# EAGLE design actik-retrofit-r1 (EAGLE 9.6.2)
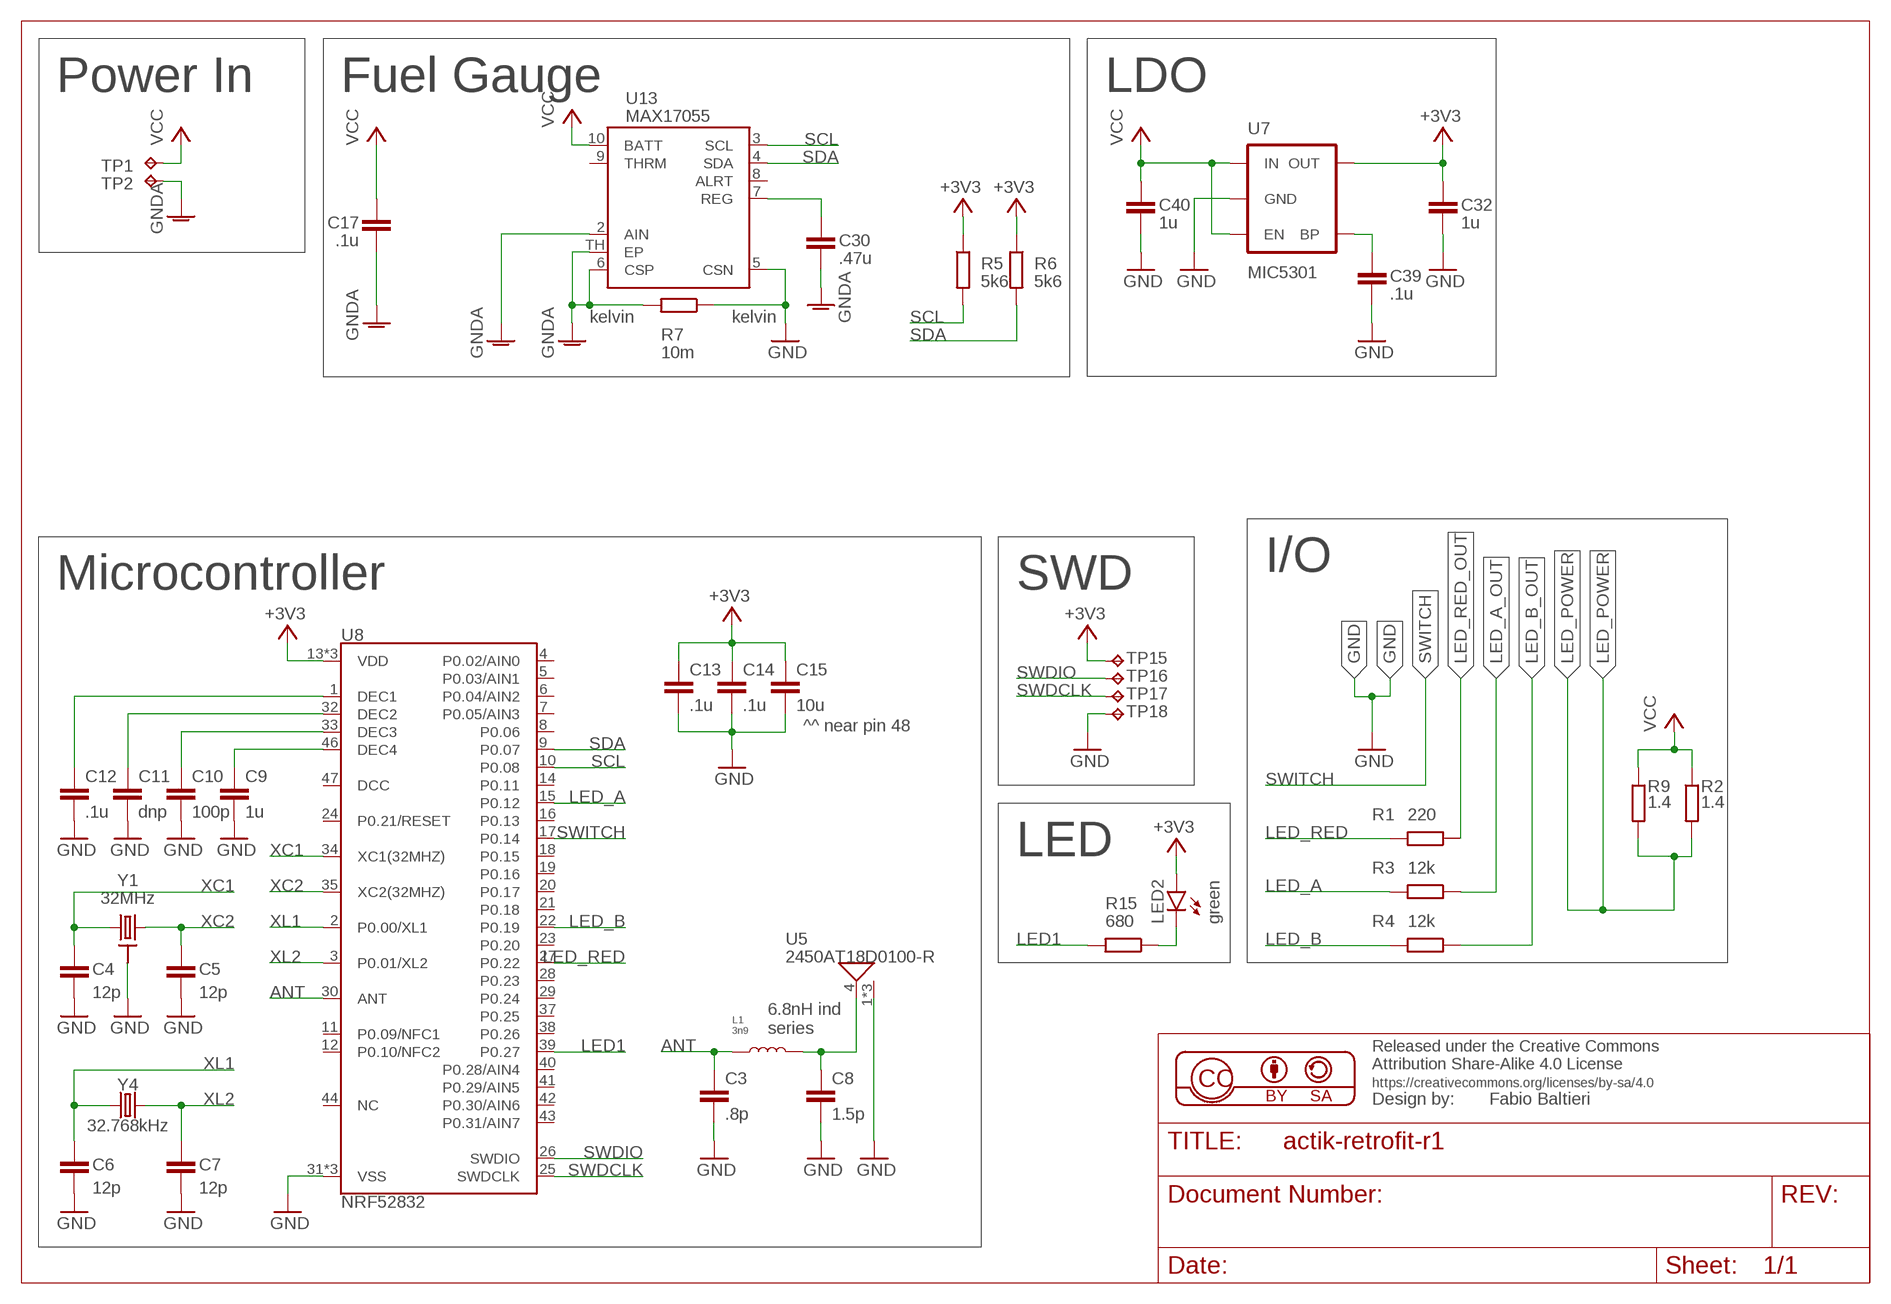
[diagram p0: schematic, sheet 1]

## Parts
C3  .8p  C0603  [0603]
C4  12p  C0603  [0603]
C5  12p  C0603  [0603]
C6  12p  C0603  [0603]
C7  12p  C0603  [0603]
C8  1.5p  C0603  [0603]
C9  1u  C0603  [0603]
C10  100p  C0603  [0603]
C11  dnp  C0603  [0603]
C12  .1u  C0603  [0603]
C13  .1u  C0603  [0603]
C14  .1u  C0603  [0603]
C15  10u  C0603  [0603]
C17  .1u  C0603  [0603]
C30  .47u  C0603  [0603]
C32  1u  C0603  [0603]
C39  .1u  C0603  [0603]
C40  1u  C0603  [0603]
L1  3n9  INDUCTOR_0603  [L0603]
LED2  green  LEDSML0805  [SML0805]
R1  220  R0603  [0603]
R2  1.4  R-EU_R3225  [R3225]
R3  12k  R0603  [0603]
R4  12k  R0603  [0603]
R5  5k6  R0603  [0603]
R6  5k6  R0603  [0603]
R7  10m  R0603  [0603]
R9  1.4  R-EU_R3225  [R3225]
R15  680  R0603  [0603]
TP1  TPPAD1-13  [P1-13]
TP2  TPPAD1-13  [P1-13]
TP15  TPTP10R  [TP10R]
TP16  TPTP10R  [TP10R]
TP17  TPTP10R  [TP10R]
TP18  TPTP10R  [TP10R]
U5  2450AT18D0100-R  [2450AT18D0100-R]
U7  MIC5301  V_REG_LDOSMD  [SOT23-5]
U8  NRF52832  [QFN48-6X6MM]
U13  MAX17055  [TDFN10-2X2.5]
Y1  32MHz  XTAL-GND-2X1.6  [XTAL-2X1.6]
Y4  32.768kHz  CRYSTAL-32.768KHZSMD-3.2X1.5  [CRYSTAL-SMD-3.2X1.5MM]

## Nets
+3V3: C13.1 C14.1 C15.1 C32.1 LED2.A R5.1 R6.1 TP15.TP U7.5(OUT) U8.13(VDD) U8.36(VDD) U8.48(VDD)
ANT: C3.1 L1.P$1 U8.30(ANT)
GND: C3.2 C4.2 C5.2 C6.2 C7.2 C8.2 C9.2 C10.2 C11.2 C12.2 C13.2 C14.2 C15.2 C32.2 C39.2 C40.2 R7.1 TP18.TP U5.1(GND) U5.2(GND) U5.3(GND) U7.2(GND) U8.31(VSS) U8.45(VSS) U8.EP(VSS) U13.5(CSN) Y1.2(GND) Y1.4(GND)
GNDA: C17.2 C30.2 R7.2 TP2.TP U13.2(AIN) U13.6(CSP) U13.TH(EP)
LED1: R15.2 U8.39(P0.27)
LED_A: R3.2 U8.15(P0.12)
LED_A_OUT: R3.1
LED_B: R4.2 U8.22(P0.19)
LED_B_OUT: R4.1
LED_POWER: R2.2 R9.2
LED_RED: R1.2 U8.27(P0.22)
LED_RED_OUT: R1.1
N$1: C8.1 L1.P$2 U5.4(FEED)
N$2: C9.1 U8.46(DEC4)
N$3: C10.1 U8.33(DEC3)
N$4: C11.1 U8.32(DEC2)
N$5: C12.1 U8.1(DEC1)
N$23: LED2.C R15.1
N$30: C39.1 U7.4(BP)
N$47: C30.1 U13.7(REG)
SCL: R5.2 U8.10(P0.08) U13.3(SCL)
SDA: R6.2 U8.9(P0.07) U13.4(SDA)
SWDCLK: TP17.TP U8.25(SWDCLK)
SWDIO: TP16.TP U8.26(SWDIO)
SWITCH: U8.17(P0.14)
VCC: C17.1 C40.1 R2.1 R9.1 TP1.TP U7.1(IN) U7.3(EN) U13.10(BATT)
XC1: C4.1 U8.34(XC1(32MHZ)) Y1.1
XC2: C5.1 U8.35(XC2(32MHZ)) Y1.3
XL1: C6.1 U8.2(P0.00/XL1) Y4.P$1
XL2: C7.1 U8.3(P0.01/XL2) Y4.P$2
Unconnected: U8.4(P0.02/AIN0) U8.5(P0.03/AIN1) U8.6(P0.04/AIN2) U8.7(P0.05/AIN3) U8.8(P0.06) U8.11(P0.09/NFC1) U8.12(P0.10/NFC2) U8.14(P0.11) U8.16(P0.13) U8.18(P0.15) U8.19(P0.16) U8.20(P0.17) U8.21(P0.18) U8.23(P0.20) U8.24(P0.21/RESET) U8.28(P0.23) U8.29(P0.24) U8.37(P0.25) U8.38(P0.26) U8.40(P0.28/AIN4) U8.41(P0.29/AIN5) U8.42(P0.30/AIN6) U8.43(P0.31/AIN7) U8.44(NC) U8.47(DCC) U13.8(ALRT) U13.9(THRM)

## Notes on the sheet
- Power In | Fuel Gauge | LDO
- kelvin | kelvin
- I/O
- Microcontroller | SWD
- ^^ near pin 48
- LED
- 6.8nH ind
  series

## Library data of the parts
C3-C15 C17 C30 C32 C39 C40 = balto:C: Capacitor
L1 = MF_Passives:INDUCTOR: Library: MF_Passives Description: Device for Inductors. Manufacture part number (MPN) can be added via Attributes. Check https://factory.macrofab.com/parts for the house parts list.; POPULATE: 1
LED2 = led:LED: LED OSRAM: - CHIPLED LG R971, LG N971, LY N971, LG Q971, LY Q971, LO R971, LY R971 LH N974, LH R974 LS Q976, LO Q976, LY Q976 LO Q996 - Hyper CHIPLED LW Q18S LB Q993, LB Q99A, LB R99A - SideLED LS A670, LO A670, LY A670, LG A670, LP A670 LB A673, LV A673, LT A673, LW A673 LH A674 LY A675 LS A676, LA A676, LO A676, LY A676, LW A676 LS A679, LY A679, LG A679 - Hyper Micro SIDELED® LS Y876, LA Y876, LO Y876, LY Y876 LT Y87S - SmartLED LW L88C, LW L88S LB L89C, LB L89S, LG L890 LS L89K, LO L89K, LY L89K LS L896, LA L896, LO L896, LY L896 - TOPLED LS T670, LO T670, LY T670, LG T670, LP T670 LSG T670, LSP T670, LSY T670, LOP T670, LYG T670 LG T671, LOG T671, LSG T671 LB T673, LV T673, LT T673, LW T673 LH T674 LS T676, LA T676, LO T676, LY T676, LB T676, LH T676, LSB T676, LW T676 LB T67C, LV T67C, LT T67C, LS T67K, LO T67K, LY T67K, LW E67C LS E67B, LA E67B, LO E67B, LY E67B, LB E67C, LV E67C, LT E67C LW T67C LS T679, LY T679, LG T679 LS T770, LO T770, LY T770, LG T770, LP T770 LB T773, LV T773, LT T773, LW T773 LH T774 LS E675, LA E675, LY E675, LS T675 LS T776, LA T776, LO T776, LY T776, LB T776 LHGB T686 LT T68C, LB T68C - Hyper Mini TOPLED® LB M676 - Mini TOPLED Santana® LG M470 LS M47K, LO M47K, LY M47K Source: http://www.osram.convergy.de LUXEON: - LUMILED® LXK2-PW12-R00, LXK2-PW12-S00, LXK2-PW14-U00, LXK2-PW14-V00 LXK2-PM12-R00, LXK2-PM12-S00, LXK2-PM14-U00 LXK2-PE12-Q00, LXK2-PE12-R00, LXK2-PE12-S00, LXK2-PE14-T00, LXK2-PE14-U00 LXK2-PB12-K00, LXK2-PB12-L00, LXK2-PB12-M00, LXK2-PB14-N00, LXK2-PB14-P00, LXK2-PB14-Q00 LXK2-PR12-L00, LXK2-PR12-M00, LXK2-PR14-Q00, LXK2-PR14-R00 LXK2-PD12-Q00, LXK2-PD12-R00, LXK2-PD12-S00 LXK2-PH12-R00, LXK2-PH12-S00 LXK2-PL12-P00, LXK2-PL12-Q00, LXK2-PL12-R00 Source: www.luxeon.com KINGBRIGHT: KA-3528ASYC Source: www.kingbright.com
R1 R3-R7 R15 = balto:R: Resistor
R2 R9 = rcl:R-EU_: RESISTOR, European symbol; SPICEPREFIX: R
TP1 TP2 TP15-TP18 = testpad:TP: Test pad
U5 = balto:2450AT18D0100: 2.45 GHz SMD Antenna, EIA 1210, Detuning resilient, Edge Mount Design
U7 = SparkFun-PowerIC:V_REG_LDO: Voltage Regulator LDO Standard 150mA LDO voltage regulator in SOT-23 layout. Micrel part MIC5205. BP (by-pass) pin is used to lower output noise with 470pF cap.
U8 = SparkFun-RF:NRF52832: Nordic nRF52832 Bluetooth Smart/ANT/2.4GHz RF SoC The nRF52832 SoC is a powerful, highly flexible ultra-low power multiprotocol SoC ideally suited for Bluetooth® Smart ANT and 2.4GHz ultra low-power wireless applications. The nRF52832 SoC is built around a 32-bit ARM® Cortex™-M4F CPU with 512kB + 64kB RAM. The embedded 2.4GHz transceiver supports Bluetooth Smart, ANT and proprietary 2.4 GHz protocol stack. It is on air compatible with the nRF51 Series, nRF24L and nRF24AP Series products from Nordic Semiconductor. Datasheet <https://cdn.sparkfun.com/datasheets/Wireless/Bluetooth/nRF52832_PS_v1.0.pdf> SparkFun Products: SparkFun nRF52832 Breakout <https://www.sparkfun.com/products/13990>; PROD_ID: IC-13460
U13 = balto:MAX17055: 7μA 1-Cell Fuel Gauge with ModelGauge m5 EZ
Y1 = balto:XTAL-GND: Crystal Oscillator with GND
Y4 = SparkFun-Clocks:CRYSTAL-32.768KHZ: 32.768kHz Crystal Frequency: 32.768kHz Frequency Stability: ±20ppm Load Capacitance: 12.5pF (PTH-2X6 & SMD-3.2X1.5), 6pF (SMD-2X6) SparkFun Products: SparkFun BigTime Watch Kit <https://www.sparkfun.com/products/11734> SparkFun nRF52832 Breakout <https://www.sparkfun.com/products/13990> SparkFun Real Time Clock Module <https://www.sparkfun.com/products/12708>; PROD_ID: XTAL-13062

## Net classes
0 default: width 0.2 mm

## Board
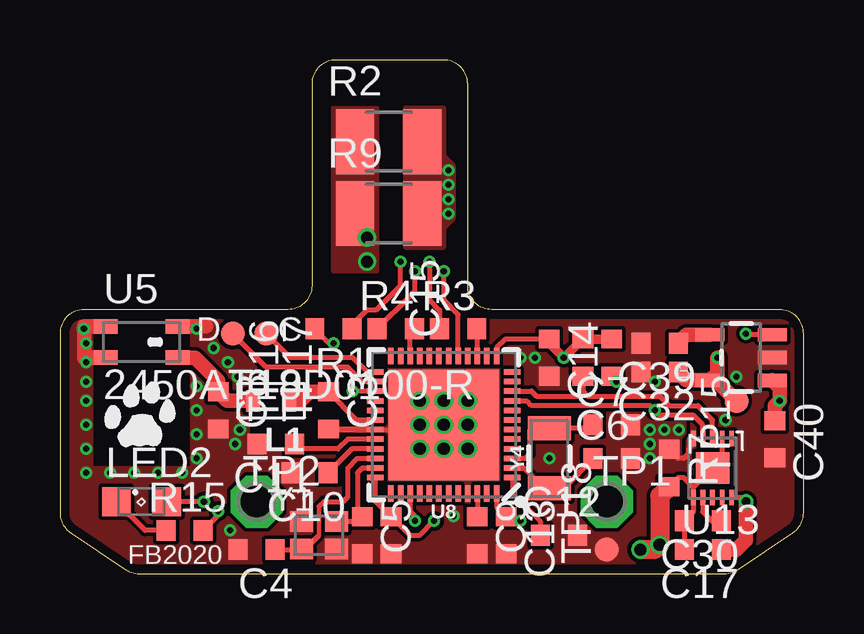
[diagram p1: board, top side]
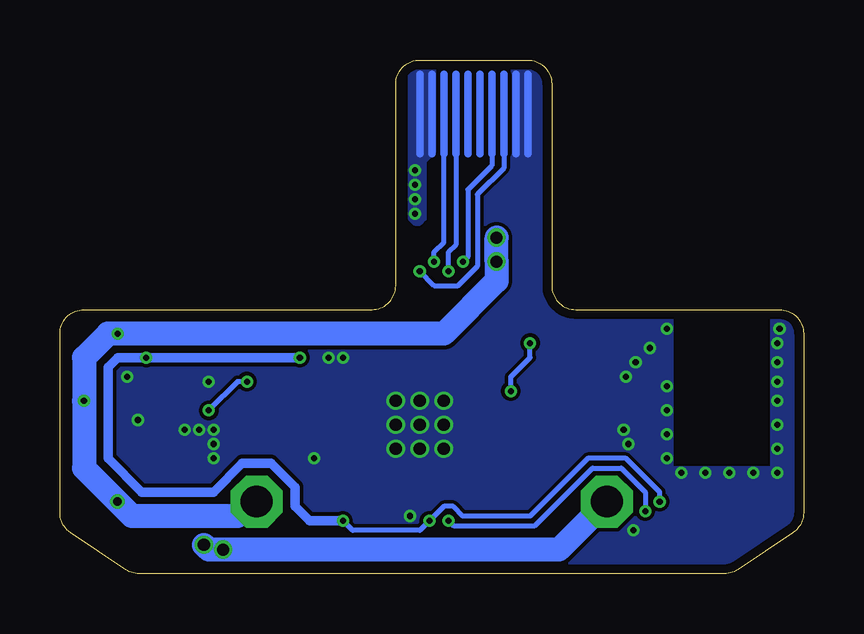
[diagram p2: board, bottom side, seen from below]

Size 31 x 21.4 mm. Coordinates in mm from the lower left corner, seen from the top.
Outline: 17,12 17,20.4 arc90 16,21.4 11.5,21.4 arc90 10.5,20.4 10.5,12 arc-90 9.5,11 1,11 arc90 0,10 0,2.54 arc56 0.45,1.7 2.75,0.17 arc34 3.3,0 27.7,0 arc34 28.25,0.17 30.55,1.7 arc56 31,2.54 31,10 arc90 30,11 18,11 arc-90 17,12
Copper layers (1*16): Top 0.035mm / dielectric 1.5mm / Bottom 0.035mm
Design rules "balto *": minimum track width 6mil, minimum drill 10mil, track to track 6mil, track to pad 6mil, pad to pad 6mil, via to via 6mil, smd to smd 6mil, copper to edge 15mil, drill to drill 5mil, minimum pad ring 5mil, minimum via ring 5mil, stop-mask expansion 2mil, vias tented up to drill 20mil, thermal gap 8mil
tRestrict: 3 lines

### Footprints (pad centres in the part's own frame; a part is rotated, then mirrored left to right if it is on the bottom)
0603 = smd 0.787 x 0.864: 1 -0.774,0; 2 0.774,0
L0603 = smd 0.6 x 0.9: P$1 -0.75,0; P$2 0.75,0
SML0805 = smd 1.2 x 1.2: A 1.05,0; C -1.05,0
R3225 = smd 1.6 x 2.7: 1 -1.4,0; 2 1.4,0
P1-13 = drill 1.321 pad 2.159 octagon: TP 0,0
TP10R = smd 1 x 1: TP 0,0
2450AT18D0100-R = smd 1 x 0.6: 1 1.5,0.65; 2 -1.5,0.65; 3 -1.5,-0.65; 4 1.5,-0.65
SOT23-5 = smd 0.55 x 1.2: 1 -0.95,-1.3; 2 0,-1.3; 3 0.95,-1.3; 4 0.95,1.3; 5 -0.95,1.3
QFN48-6X6MM = smd 0.68 x 0.23: 1 -2.86,2.2; 2 -2.86,1.8; 3 -2.86,1.4; 4 -2.86,1; 5 -2.86,0.6; 6 -2.86,0.2; 7 -2.86,-0.2; 8 -2.86,-0.6; 9 -2.86,-1; 10 -2.86,-1.4; 11 -2.86,-1.8; 12 -2.86,-2.2; 25 2.86,-2.2; 26 2.86,-1.8; 27 2.86,-1.4; 28 2.86,-1; 29 2.86,-0.6; 30 2.86,-0.2; 31 2.86,0.2; 32 2.86,0.6; 33 2.86,1; 34 2.86,1.4; 35 2.86,1.8; 36 2.86,2.2 | smd 0.23 x 0.68: 13 -2.2,-2.86; 14 -1.8,-2.86; 15 -1.4,-2.86; 16 -1,-2.86; 17 -0.6,-2.86; 18 -0.2,-2.86; 19 0.2,-2.86; 20 0.6,-2.86; 21 1,-2.86; 22 1.4,-2.86; 23 1.8,-2.86; 24 2.2,-2.86; 37 2.2,2.86; 38 1.8,2.86; 39 1.4,2.86; 40 1,2.86; 41 0.6,2.86; 42 0.2,2.86; 43 -0.2,2.86; 44 -0.6,2.86; 45 -1,2.86; 46 -1.4,2.86; 47 -1.8,2.86; 48 -2.2,2.86 | smd 4.6 x 4.6: EP 0,0
TDFN10-2X2.5 = smd 0.2 x 0.65: 1 -0.8,-1.225; 2 -0.4,-1.225; 3 0,-1.225; 4 0.4,-1.225; 5 0.8,-1.225; 6 0.8,1.225; 7 0.4,1.225; 8 0,1.225; 9 -0.4,1.225; 10 -0.8,1.225 | smd 1.4 x 1.3: TH 0,0
XTAL-2X1.6 = smd 0.95 x 0.85: 1 -0.725,-0.575; 2 0.725,-0.575; 3 0.725,0.575; 4 -0.725,0.575
CRYSTAL-SMD-3.2X1.5MM = smd 1 x 1.8: P$1 -1.25,0; P$2 1.25,0

### Placement (x,y rotation side)
C3  11.2,6.8 270 top
C4  8.2,1 180 top
C5  12.6,1.6 270 top
C6  23,4.8 0 top
C7  23,6.2 0 top
C8  6.6,6.8 270 top
C9  17.4,1.6 270 top
C10  10.4,4.2 180 top
C11  9,5.4 180 top
C12  20.8,1.6 0 top
C13  18.6,1.6 270 top
C14  20.4,9 270 top
C15  13.8,1.6 270 top
C17  26.8,1 180 top
C30  26.8,2.2 180 top
C32  25,8.4 180 top
C39  25,9.6 180 top
C40  29.8,5.6 270 top
L1  8.8,7.2 180 top
LED2  3.4,3 0 top
R1  11.4,10.2 180 top
R2  13.7,18 0 top
R3  16.6,10.2 0 top
R4  14,10.2 0 top
R5  21.8,9 270 top
R6  23,9 270 top
R7  25.4,4.4 270 top
R9  13.7,15 0 top
R15  5.2,1.8 0 top
TP1  22.8,3 0 top
TP2  8.2,3 0 top
TP15  28.2,7.2 90 top
TP16  7.2,10 270 top
TP17  8.6,10 270 top
TP18  22.8,1 90 top
U5  3.4,9.65 0 top
U7  28.4,9 90 top
U8  16,6.2 180 top
U13  27.2,4.4 180 top
U$1  [CAT-L]  3.4,6.2 0 top
Y1  10.8,1.6 0 top
Y4  20.4,4.8 90 top

### Tracks (layer width: path | path; a pad name or v marks a point on that pad's centre or on a via)
+3V3  (via drill 0.25)
  Top 0.2: U8.36 13.14,3.03 C15.1 13.82,2.37 14.6,1.6 15,1.6 v15.6,2.2 | C14.1 18.57,9.77 18.2,9.4 U8.13 | U8.48 18.2,2.77 C13.1 18.77,2.2 v19.2,2.2 | v6,3 LED2.A
  Top 0.4: C14.1 20.4,9.6 v21,9 21.77,9.77 R5.1 R6.1
  Top 0.6: U7.5 27.35,8.05 TP15.TP | U7.5 26.12,8.05 C32.1 | U7.5 27.4,8.35 v27.4,9
  Bottom 0.2: v6,3 6,3.4 7.4,4.8 9,4.8 11.4,2.4 14.2,2.4 14.6,2.8 15,2.8 v15.6,2.2 16,1.8 18.8,1.8 v19.2,2.2
  Bottom 0.4: v19.2,2.2 20.6,2.2 21.2,2.8 21.2,3.6 22.2,4.6 23.4,4.6 24.6,3.4 27.6,3.4 29,4.8 29,8.6 28.6,9 v27.4,9 v21,9
ANT
  Top 0.2: U8.30 12.37,6.4 C3.1
  Top 0.6: C3.1 10.4,7.57 10.03,7.2 L1.P$1
DNC1
  Bottom 0.32: 13.5,20.8 13.5,17.5
DNC2
  Bottom 0.32: 14,20.8 14,17.5
GND  (via drill 0.25, 0.51)
  Top 0.2: U8.31 14.6,6 | U13.5 26.4,5.4 26.2,5.2 26.2,5 26,4.8 25.77,4.8 R7.1
  Top 0.25: U8.31 11.23,6 C3.2
  Top 0.6: U5.1 6.1,10.3 | U5.2 1,10.3 1,9 U5.3
  Bottom 0.32: 11.5,20.8 11.5,17.5 | 12,20.8 12,17.5
  other vias: 16,6.2 16,7.2 17,7.2 17,6.2 15,6.2 15,7.2 16,5.2 15,5.2 17,5.2 5.7,10.2 1,10.2 24.6,4.8 24.6,5.4 25.2,6 16.4,2.4 19.8,9 19.2,9 24.8,8 25.8,6 7.4,8.2 6.4,9.4 7,8.8 5.7,7.8 5.7,6.8 5.7,5.8 5.7,4.8 5.1,4.2 4.1,4.2 3.1,4.2 2.1,4.2 1.1,4.2 1.1,5.2 1.1,6.2 1.1,7.2 1.1,8 1.1,8.8 1.1,9.6 7.1,1.8 7.5,6 7.3,5.4 28.2,8.2 27.75,6.4 24.6,6 20.4,4.8
  pour Top (rank 2, no thermals): -1,-1 32,-1 32,21.3 -1,21.3
  pour Bottom (rank 2, no thermals): -2,-2 33,-2 33,21.8 -2,21.8
GNDA  (via drill 0.51)
  Top 0.2: U13.2 27.6,4.8 U13.TH 26.4,3.6 | C17.2 C30.2 26.4,2.58 U13.6 26.4,3.6 | 26.4,3.6 26,4 25.77,4 R7.2
  Top 0.8: R7.2 25,3.23 v25,1.2 24.8,1 v24.2,1
  Bottom 1: TP2.TP 10.2,1 24.8,1 v25,1.2
LED1  (via drill 0.25)
  Top 0.2: U8.39 14.6,2.6 14.8,2.4 v14.8,2.2 | v6.6,2.6 6.6,2.42 R15.2
  Bottom 0.2: v14.8,2.2 14.6,2 11.2,2 8.8,4.4 7.6,4.4 6.6,3.4 v6.6,2.6
LED_A
  Top 0.2: U8.15 17.4,10.18 R3.2
LED_A_OUT  (via drill 0.25)
  Top 0.2: v15.4,13 15.4,11.4 15.82,10.97 R3.1
  Bottom 0.2: v15.4,13 15.4,13.4 15,13.8 15,17.5
  Bottom 0.32: 15,20.8 15,17.5
LED_B
  Top 0.2: U8.22 14.6,10.03 R4.2
LED_B_OUT  (via drill 0.25)
  Top 0.2: R4.1 14.61,11.59 14.8,11.77 v14.8,12.6
  Bottom 0.2: v14.8,12.6 14.8,13.4 14.5,13.7 14.5,17.5
  Bottom 0.32: 14.5,20.8 14.5,17.5
LED_POWER  (via drill 0.25)
  Bottom 0.32: 15.5,20.8 15.5,17.5 | 16,20.8 16,17.5
  other vias: 16.2,15.6 16.2,16.2 16.2,16.8 16.2,15
  pour Top (no thermals): 14.4,19.4 14.4,13.6 16,13.6 16,14.4 16.4,14.8 16.4,17 16,17.4 16,19.4
  pour Bottom (no thermals): 15.4,21 16.4,21 16.4,14.8 16.2,14.6 16,14.6 15.8,14.8 15.8,17.2 15.4,17.6
LED_RED  (via drill 0.25)
  Top 0.2: U8.27 v12.2,7.6 | v11.4,9.6 11.23,9.6 R1.2
  Bottom 0.2: v12.2,7.6 12.2,8.2 11.4,9 v11.4,9.6
LED_RED_OUT  (via drill 0.25)
  Top 0.2: R1.1 12.18,10.37 12.8,11 13.2,11 14.2,12 v14.2,13
  Bottom 0.2: v14.2,13 14,13.2 14,16 13,17 13,17.5
  Bottom 0.32: 13,20.8 13,17.5
N$1
  Top 0.6: U5.4 5.62,9 6.6,8.03 C8.1 6.97,7.2 L1.P$2
N$2
  Top 0.2: U8.46 C9.1
N$3
  Top 0.2: U8.33 12.18,5.2 C10.1
N$4
  Top 0.2: U8.32 12,5.6 11.6,5.2 9.97,5.2 C11.1
N$5
  Top 0.18: 18.86,3.34 20.03,2.17
  Top 0.2: U8.1 18.86,3.34 | 20.03,2.17 C12.1
N$6
  cutout Top: 8,5.2 12.2,5.2 12.2,8.4 8,8.4
N$23
  Top 0.2: R15.1 3.55,1.8 LED2.C
N$30
  Top 0.6: U7.4 26.12,9.95 C39.1
N$47
  Top 0.2: U13.7 26.8,2.58 27.17,2.2 C30.1
SCL
  Top 0.2: U8.10 19.66,7.6 19.86,7.4 21.6,7.4 21.8,7.6 | U13.3 27.2,6.4 26.6,7 25.4,7 25,7.4 22,7.4 21.8,7.6 | R5.2 21.8,7.6
SDA  (via drill 0.25)
  Top 0.2: U8.9 19.46,7.2 19.66,7 24.6,7 v24.8,6.8 25,6.6 26.4,6.6 26.8,6.2 U13.4 | R6.2 23.2,8.03 v23.2,8
  Bottom 0.2: v23.2,8 23.6,8 v24.8,6.8
SWDCLK
  Top 0.2: U8.25 12.8,8.4 12.2,9 9.6,9 TP17.TP
SWDIO
  Top 0.2: U8.26 12.6,8 12,8.6 8.6,8.6 TP16.TP
SWITCH  (via drill 0.25)
  Top 0.2: U8.17 16.6,10.8 16,11.4 v16,12.6
  Bottom 0.2: 12.5,17.5 12.5,16.9 13.6,15.8 13.6,12.8 14.4,12 15.4,12 v16,12.6
  Bottom 0.32: 12.5,20.8 12.5,17.5
VCC  (via drill 0.25, 0.35, 0.51)
  Top 0.2: U7.3 28.65,9.95 v28.6,10 | U13.10 28.43,3.17 v28.6,3
  Top 0.6: U7.1 30,7.75 v30,7.2 29.8,7 C40.1 | C17.1 28.2,1 28.6,1.4 v28.6,3
  Bottom 1: TP1.TP 23,3 23.6,2.4 28,2.4 v28.6,3 30,4.4 v30,7.2 30,9 29,10 v28.6,10 15,10 12.8,12.2 v12.8,13 v12.8,14
  pour Top (no thermals): 11.4,19.4 13.2,19.4 13.2,12.6 11.4,12.6
XC1
  Top 0.18: 10.8,1.6 10.8,2.8
  Top 0.2: C4.1 10.05,1 Y1.1 10.22,1.02 10.8,1.6 | 10.8,2.8 11,3 11.8,3 12,3.2 12,4.4 12.4,4.8 U8.34
XC2
  Top 0.2: U8.35 12.6,4.4 12.4,4.2 12.4,2.58 C5.1 12.4,2.17 Y1.3
XL1
  Top 0.2: U8.2 19.35,4.4 20.2,3.55 Y4.P$1 21,3.55 22.23,4.78 C6.1
XL2
  Top 0.2: U8.3 19.4,4.8 19.6,5 19.6,6 19.65,6.05 Y4.P$2 22.08,6.05 C7.1

### Text on the board
_tsilk: D | C | FB2020